# Altium schematic sheet DAC8830V1.0.schdoc
size A4
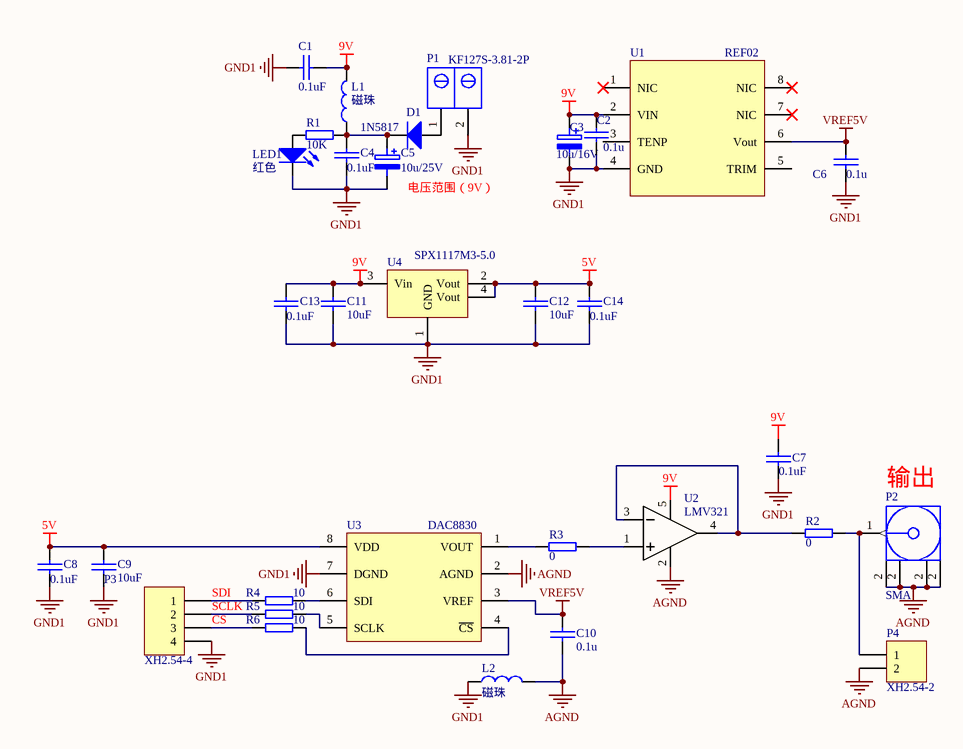
[diagram p0: DAC8830V1.0.schdoc]

## Parts
C1  0.1uF  [0805]
C2  0.1u  [0805]
C3  10u/16V  [1206]
C4  0.1uF  [0805]
C5  10u/25V  [1206]
C6  0.1u  [0805]
C7  0.1uF  [0805]
C8  0.1uF  [0805]
C9  10uF  [1206]
C10  0.1u  [0805]
C11  10uF  [1206]
C12  10uF  [1206]
C13  0.1uF  [0805]
C14  0.1uF  [0805]
D1  1N5817  [二极管 贴片 2010]
L1  磁珠  [0805]
L2  磁珠  [0805]
LED1  红色  [LED0805]
P1  KF127S-3.81-2P  [KF127S-3.81-2P]
P2  SMA  [天线座 50ohm 侧卧]
P3  XH2.54-4  [VH2.54_4]
P4  XH2.54-2  [VH2.54_2]
R1  10K  [0805]
R2  0  [0805]
R3  0  [0805]
R4  10  [0805]
R5  10  [0805]
R6  10  [0805]
U1  REF02  [SOIC8]
U2  LMV321  [SOT23-5]
U3  DAC8830  [soic8]
U4  SPX1117M3-5.0  [SOT223]

## Nets
5V: C8.2 C9.2 C12.2 C14.2 U3.8(VDD) U4.2(Vout) U4.4(Vout)
9V: C1.1 C2.1 C3.1 C7.2 C11.2 C13.2 L1.2 U1.2(VIN) U2.5(VCC) U4.3(Vin)
AGND: C10.2 L2.2 P2.2 P4.2 U2.2(GND) U3.2(AGND)
GND1: C1.2 C2.2 C3.2 C4.1 C5.2 C6.2 C7.1 C8.1 C9.1 C11.1 C12.1 C13.1 C14.1 L2.1 LED1.2(K) P1.2 P3.4 U1.4(GND) U3.7(DGND) U4.1(GND)
VREF5V: C6.1 C10.1 U1.6(Vout) U3.3(VREF)
CS: P3.3 R6.2
SCLK: P3.2 R5.2
SDI: P3.1 R4.2
NetC4_2: C4.2 C5.1 D1.2(K) L1.1 R1.2
NetD1_1: D1.1(A) P1.1
NetLED1_1: LED1.1(A) R1.1
NetP2_1: P2.1(Signal) P4.1 R2.2
NetR2_1: R2.1 U2.3(IN-) U2.4(OUT)
NetR3_1: R3.1 U2.1(IN+)
NetR3_2: R3.2 U3.1(VOUT)
NetR4_1: R4.1 U3.6(SDI)
NetR5_1: R5.1 U3.5(SCLK)
NetR6_1: R6.1 U3.4(~{CS})

Not connected (* = marked no-connect by the designer): U1 1(NIC)* 3(TENP) 5(TRIM) 7(NIC)* 8(NIC)*

## Notes on the sheet
- (near C5) 电压范围（9V）
- (near P2) 输出

## Library data of the parts
C1 C2 C4 C6-C8 C10 C13 C14 = 电容 贴片 0805: 名称: 贴片电容; 单位: 个; 封装: 0805
C3 C5 = 电容 贴片 铝电解100u/25V: 名称: 贴片铝电解电容; 封装: 贴片; 单位: 个
C9 C11 C12 = 电容 贴片 0805: 名称: 贴片电容; 封装: 0805; 单位: 个
D1 = 二极管 贴片1N5817: 名称: 贴片二极管; 封装: 贴片; 单位: 个
L1 L2 = 磁珠: 单位: 个; 名称: 磁珠; 封装: 0805
LED1 = 二极管 贴片发光 0805: 名称: 贴片发光二极管; 封装: 0805; 单位: 个
P1 = 连接件 KF127S-3.81-2P: 名称: 连接件; 单位: 套; 封装: KF127S-3.81-2p
P2 = 联结件 天线座 SMA: 单位: 个; 封装: 直插; 名称: 联接件
P3 = 连接件 XH2.54-4: 名称: 连接件; 单位: 套; 封装: XH2.54-4
P4 = 连接件 XH2.54-2: 名称: 连接件; 封装: VH3.96-2; 单位: 套
R1-R6 = 电阻 贴片 0805: 名称: 贴片电阻; 单位: 个; 封装: 0805
U1 = 贴片芯片 ADR02: 单位: 片; 名称: ADR02; 封装: SOIC8
U2 = 贴片芯片 LMV321: 单位: 个; 名称: 芯片; 封装: SOT23-5
U3 = 贴片芯片 DAC8830: 单位: 片; 名称: 贴片芯片; 封装: soic8
U4 = 贴片芯片 SPX1117M3-5.0: LDO; 名称: 贴片芯片; 单位: 个; 封装: SOT223